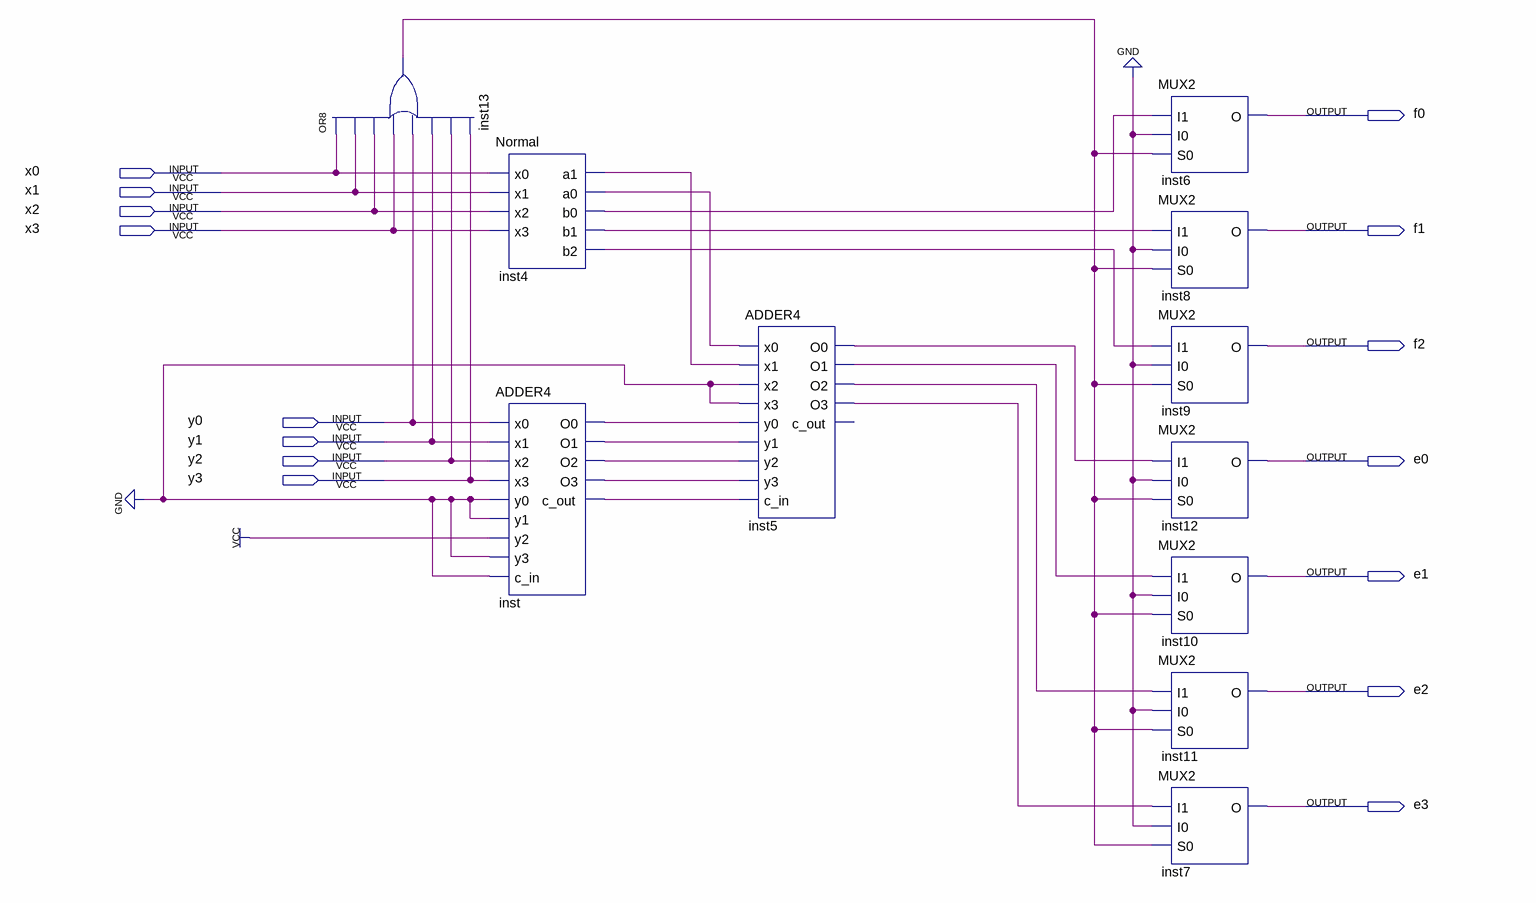
[diagram p0: schematic sheet]
// Quartus schematic Normalizer.bdf as structural Verilog: 11 symbols, 15 pins
module Normalizer (
  input  x0,
  input  x1,
  input  x2,
  input  x3,
  input  y0,
  input  y1,
  input  y2,
  input  y3,
  output f0,
  output f1,
  output f2,
  output e0,
  output e1,
  output e2,
  output e3
);

  wire inst4_a0, inst4_a1, inst4_b0, inst4_b1, inst4_b2, inst5_o0, inst5_o1, inst5_o2, inst5_o3, inst13_out,
       inst_c_out, inst_o0, inst_o1, inst_o2, inst_o3;

  or inst13 (inst13_out, x0, x1, x2, x3, y0, y1, y2, y3);
  Normal inst4 (
    .x0(x0), .x1(x1), .x2(x2), .x3(x3), .a1(inst4_a1), .a0(inst4_a0), .b0(inst4_b0), .b1(inst4_b1),
    .b2(inst4_b2));
  ADDER4 inst (
    .x0(y0), .x1(y1), .x2(y2), .x3(y3), .y0(1'b0), .y1(1'b0), .y2(1'b1), .y3(1'b0), .c_in(1'b0),
    .O0(inst_o0), .O1(inst_o1), .O2(inst_o2), .O3(inst_o3), .c_out(inst_c_out));
  ADDER4 inst5 (
    .x0(inst4_a0), .x1(inst4_a1), .x2(1'b0), .x3(1'b0), .y0(inst_o0), .y1(inst_o1), .y2(inst_o2),
    .y3(inst_o3), .c_in(inst_c_out), .O0(inst5_o0), .O1(inst5_o1), .O2(inst5_o2), .O3(inst5_o3));  // open: c_out
  MUX2 inst6 (.I1(inst4_b0), .I0(1'b0), .S0(inst13_out), .O(f0));
  MUX2 inst8 (.I1(inst4_b1), .I0(1'b0), .S0(inst13_out), .O(f1));
  MUX2 inst9 (.I1(inst4_b2), .I0(1'b0), .S0(inst13_out), .O(f2));
  MUX2 inst12 (.I1(inst5_o0), .I0(1'b0), .S0(inst13_out), .O(e0));
  MUX2 inst10 (.I1(inst5_o1), .I0(1'b0), .S0(inst13_out), .O(e1));
  MUX2 inst11 (.I1(inst5_o2), .I0(1'b0), .S0(inst13_out), .O(e2));
  MUX2 inst7 (.I1(inst5_o3), .I0(1'b0), .S0(inst13_out), .O(e3));
endmodule
